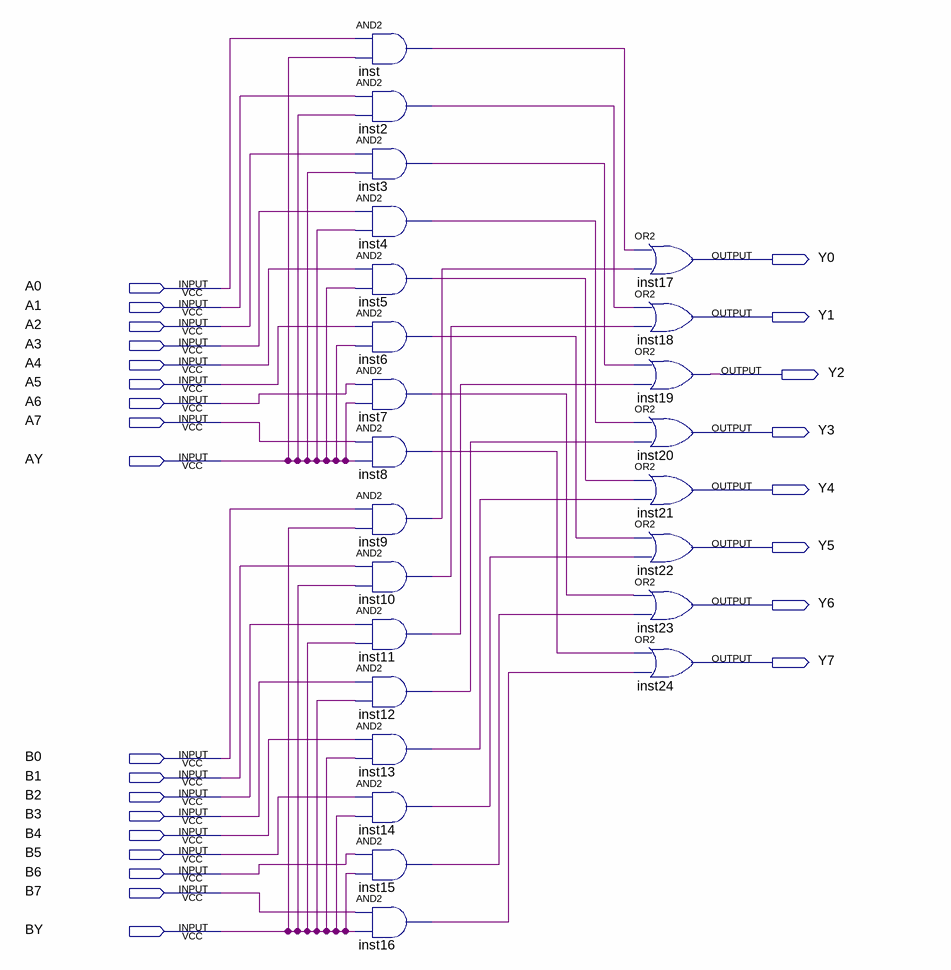
[diagram p0: schematic sheet]
// Quartus schematic 8c2.bdf as structural Verilog: 24 symbols, 26 pins
module \8c2  (
  input  A0,
  input  A1,
  input  A2,
  input  A3,
  input  A4,
  input  A5,
  input  A6,
  input  A7,
  input  AY,
  input  B0,
  input  B1,
  input  B2,
  input  B3,
  input  B4,
  input  B5,
  input  B6,
  input  B7,
  input  BY,
  output Y0,
  output Y1,
  output Y2,
  output Y3,
  output Y4,
  output Y5,
  output Y6,
  output Y7
);

  wire inst2_out, inst3_out, inst4_out, inst5_out, inst6_out, inst7_out, inst8_out, inst9_out, inst10_out,
       inst11_out, inst12_out, inst13_out, inst14_out, inst15_out, inst16_out, inst_out;

  and inst (inst_out, A0, AY);
  and inst2 (inst2_out, A1, AY);
  and inst3 (inst3_out, A2, AY);
  and inst4 (inst4_out, A3, AY);
  and inst5 (inst5_out, A4, AY);
  and inst6 (inst6_out, A5, AY);
  and inst7 (inst7_out, A6, AY);
  and inst8 (inst8_out, A7, AY);
  and inst9 (inst9_out, B0, BY);
  and inst10 (inst10_out, B1, BY);
  and inst11 (inst11_out, B2, BY);
  and inst12 (inst12_out, B3, BY);
  and inst13 (inst13_out, B4, BY);
  and inst14 (inst14_out, B5, BY);
  and inst15 (inst15_out, B6, BY);
  and inst16 (inst16_out, B7, BY);
  or inst17 (Y0, inst_out, inst9_out);
  or inst18 (Y1, inst2_out, inst10_out);
  or inst19 (Y2, inst3_out, inst11_out);
  or inst20 (Y3, inst4_out, inst12_out);
  or inst21 (Y4, inst5_out, inst13_out);
  or inst22 (Y5, inst6_out, inst14_out);
  or inst23 (Y6, inst7_out, inst15_out);
  or inst24 (Y7, inst8_out, inst16_out);
endmodule
